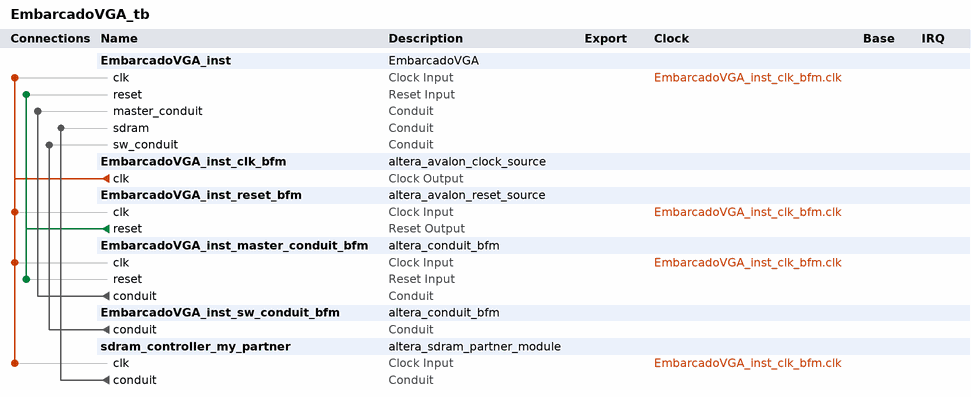
[diagram p0: system contents]
# Platform Designer (Qsys) system EmbarcadoVGA_tb, Cyclone IV E EP4CE115F29C7
# Parameters at their usual value, and those the tool derives, are not listed.
package require -exact qsys 18.1
create_system EmbarcadoVGA_tb
set_project_property DEVICE_FAMILY {Cyclone IV E}
set_project_property DEVICE EP4CE115F29C7

add_instance EmbarcadoVGA_inst EmbarcadoVGA 1.0

add_instance EmbarcadoVGA_inst_clk_bfm altera_avalon_clock_source 18.1
set_instance_parameter_value EmbarcadoVGA_inst_clk_bfm CLOCK_RATE 100000000

add_instance EmbarcadoVGA_inst_reset_bfm altera_avalon_reset_source 18.1
set_instance_parameter_value EmbarcadoVGA_inst_reset_bfm ASSERT_HIGH_RESET 0
set_instance_parameter_value EmbarcadoVGA_inst_reset_bfm INITIAL_RESET_CYCLES 50

add_instance EmbarcadoVGA_inst_master_conduit_bfm altera_conduit_bfm 18.1
set_instance_parameter_value EmbarcadoVGA_inst_master_conduit_bfm CLOCKED_SIGNAL true
set_instance_parameter_value EmbarcadoVGA_inst_master_conduit_bfm ENABLE_RESET true
set_instance_parameter_value EmbarcadoVGA_inst_master_conduit_bfm SIGNAL_DIRECTIONS input,output,output,output,input,output
set_instance_parameter_value EmbarcadoVGA_inst_master_conduit_bfm SIGNAL_ROLES exportdata,fifo_empty,fifo_full,fifo_used,fifo_wr_en,pll_locked
set_instance_parameter_value EmbarcadoVGA_inst_master_conduit_bfm SIGNAL_WIDTHS 32,1,1,9,1,1

add_instance EmbarcadoVGA_inst_sw_conduit_bfm altera_conduit_bfm 18.1
set_instance_parameter_value EmbarcadoVGA_inst_sw_conduit_bfm CLOCKED_SIGNAL false
set_instance_parameter_value EmbarcadoVGA_inst_sw_conduit_bfm ENABLE_RESET false
set_instance_parameter_value EmbarcadoVGA_inst_sw_conduit_bfm SIGNAL_DIRECTIONS output
set_instance_parameter_value EmbarcadoVGA_inst_sw_conduit_bfm SIGNAL_WIDTHS 4

add_instance sdram_controller_my_partner altera_sdram_partner_module 11.0
set_instance_parameter_value sdram_controller_my_partner CONTR_NAME EmbarcadoVGA_sdram_controller
set_instance_parameter_value sdram_controller_my_partner SDRAM_COL_WIDTH 10
set_instance_parameter_value sdram_controller_my_partner SDRAM_DATA_WIDTH 32
set_instance_parameter_value sdram_controller_my_partner SDRAM_ROW_WIDTH 13

# connections
add_connection EmbarcadoVGA_inst_clk_bfm.clk EmbarcadoVGA_inst.clk clock
add_connection EmbarcadoVGA_inst_clk_bfm.clk EmbarcadoVGA_inst_master_conduit_bfm.clk clock
add_connection EmbarcadoVGA_inst_clk_bfm.clk EmbarcadoVGA_inst_reset_bfm.clk clock
add_connection EmbarcadoVGA_inst_clk_bfm.clk sdram_controller_my_partner.clk clock
add_connection EmbarcadoVGA_inst_reset_bfm.reset EmbarcadoVGA_inst.reset reset
add_connection EmbarcadoVGA_inst_reset_bfm.reset EmbarcadoVGA_inst_master_conduit_bfm.reset reset
add_connection EmbarcadoVGA_inst_master_conduit_bfm.conduit EmbarcadoVGA_inst.master_conduit conduit
add_connection EmbarcadoVGA_inst_sw_conduit_bfm.conduit EmbarcadoVGA_inst.sw_conduit conduit
add_connection sdram_controller_my_partner.conduit EmbarcadoVGA_inst.sdram conduit

set_interconnect_requirement {$system} qsys_mm.clockCrossingAdapter HANDSHAKE
set_interconnect_requirement {$system} qsys_mm.enableEccProtection FALSE
set_interconnect_requirement {$system} qsys_mm.insertDefaultSlave FALSE
set_interconnect_requirement {$system} qsys_mm.maxAdditionalLatency 1

save_system EmbarcadoVGA_tb.qsys
